# EasyEDA Pro project ProPrj_mfswControllerV1_2026-07-03.epro

# Schematic Schematic1
Board Name: Board1; Create Date: 2026-02-06; Page Name: P1; Project Name: mfswControllerV1; Schematic Name: Schematic1; Update Date: 2026-06-21; Company: EasyEDA.com; Page Size: A4; Version: V1.0
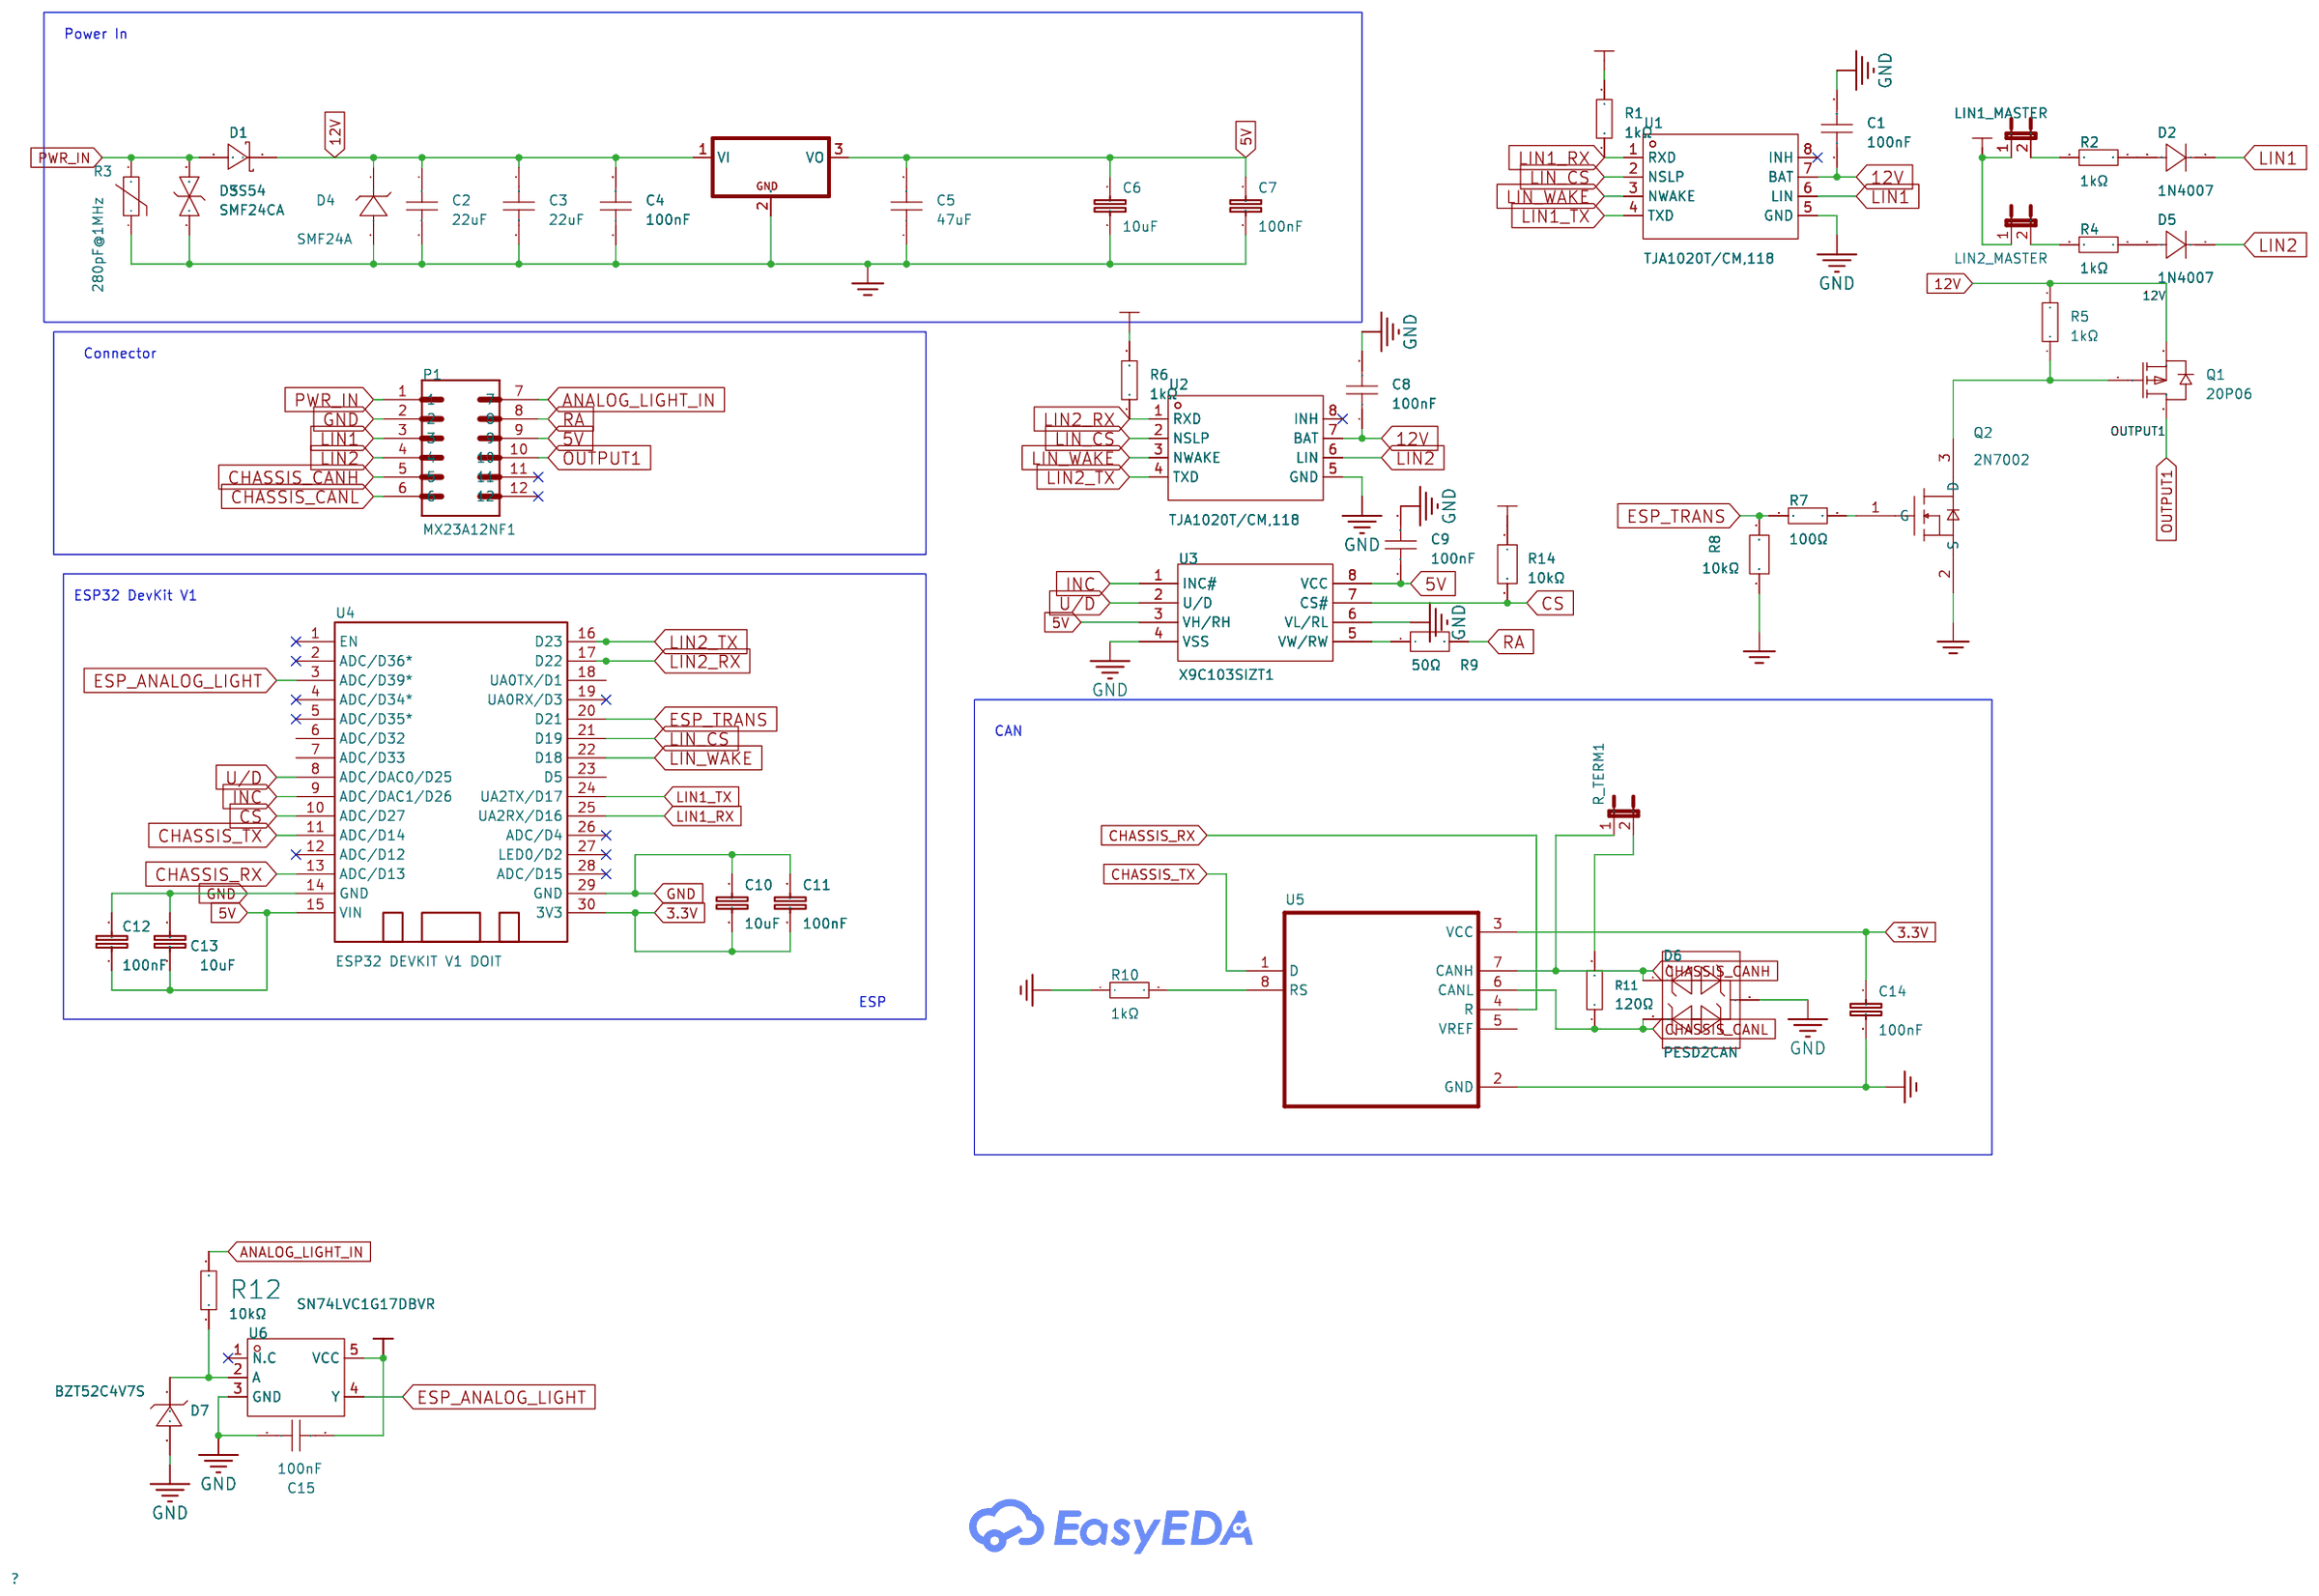
[diagram p0: schematic sheet]

## Parts
C1  100nF  [C0603]
C2  22uF  [C0805]
C3  22uF  [C0805]
C4  100nF  [C0603]
C5  47uF  [C0805]
C6  10uF  [C0805]
C7  100nF  [C0805]
C8  100nF  [C0603]
C9  100nF  [C0603]
C10  10uF  [C0805]
C11  100nF  [C0603]
C12  100nF  [C0603]
C13  10uF  [C0805]
C14  100nF  [C0805]
C15  100nF  [C0603]
D1  SS54  [SMA_L4.4-W2.8-LS5.4-R-RD]
D2  1N4007  [SMA_L4.3-W2.5-LS5.0-RD]
D3  SMF24CA  [SOD-123FL_L2.8-W1.8-LS3.7-BI]
D4  SMF24A  [SOD-123FL_L2.7-W1.8-LS3.8-RD]
D5  1N4007  [SMA_L4.3-W2.5-LS5.0-RD]
D6  PESD2CAN  [SOT-23-3_L2.9-W1.3-P1.90-LS2.4-BR]
D7  BZT52C4V7S  [SOD-323_L1.8-W1.3-LS2.5-RD]
IC1  L7805ABD2T-TR  [TO-263-2_L10.0-W9.2-P5.08-LS15.3-TL-CW]
LIN1_MASTER  PZ254V-11-02P  [HDR-TH_2P-P2.54-V-M]
LIN2_MASTER  PZ254V-11-02P  [HDR-TH_2P-P2.54-V-M]
P1  MX23A12NF1  [COON-TH_MX23A12NF1]
Q1  20P06  [TO-252-2_L6.6-W6.1-P4.57-LS9.9-BR-CW]
Q2  2N7002  [SOT-23-3_L2.9-W1.3-P1.90-LS2.4-BR]
R1  1kΩ  [R0603]
R2  1kΩ  [R0603]
R3  280pF@1MHz  [R0805]
R4  1kΩ  [R0603]
R5  1kΩ  [R0603]
R6  1kΩ  [R0603]
R7  100Ω  [R0603]
R8  10kΩ  [R0603]
R9  50Ω  [R0402]
R10  1kΩ  [R0603]
R11  120Ω  [R0603]
R12  10kΩ  [R0603]
R14  10kΩ  [R0603]
R_TERM1  PZ254V-11-02P  [HDR-TH_2P-P2.54-V-M]
U1  TJA1020T/CM,118  [SOIC-8_L4.9-W3.9-P1.27-LS6.0-BL]
U2  TJA1020T/CM,118  [SOIC-8_L4.9-W3.9-P1.27-LS6.0-BL]
U3  X9C103SIZT1  [SOIC-8_L5.0-W4.0-P1.27-LS6.0-BL]
U4  ESP32 DEVKIT V1 DOIT  [DOIT-ESP32-DEVKIT-V1]
U5  SN65HVD230DR  [SOIC-8_L4.9-W3.9-P1.27-LS6.0-BL]
U6  SN74LVC1G17DBVR  [SOT-23-5_L3.0-W1.5-P0.95-LS2.8-BL]

## Library data of the parts
C1 C4 C8 C9 C15 = CL10B104KB8NNNC: Capacitance:100nF Tolerance:±10% Tolerance:±10% Voltage Rating:50V Temperature Coefficient:X7R; LCSC Part Name: 100nF ±10% 50V; Supplier Part: C1591; Manufacturer: SAMSUNG(三星); Supplier Footprint: 0603; JLCPCB Part Class: Extended Part; Datasheet: https://item.szlcsc.com/datasheet/CL10B104KB8NNNC/1943.html; Supplier: LCSC; Tolerance: ±10%; Voltage Rating: 50V; Temperature Coefficient: X7R
C2 C3 = HGC0805R5226M350NSLJ: Capacitance: Tolerance:±20% Tolerance:±20% Voltage Rated: Temperature Coefficient:; LCSC Part Name: 22uF ±20% 35V; Supplier Part: C22367832; Manufacturer: Chinocera(华瓷); Supplier Footprint: 0805; JLCPCB Part Class: Extended Part; Datasheet: https://atta.szlcsc.com/upload/public/pdf/source/20240326/E9E9157D170E907C889ABA1F54A94302.pdf; Supplier: LCSC; Tolerance: ±20%; Standardization Check: false
C5 = CL21A476MPYNNWE: Capacitance:47uF Tolerance:±20% Tolerance:±20% Voltage Rating:10V Temperature Coefficient:X5R; LCSC Part Name: 47uF ±20% 10V; Supplier Part: C5596752; Manufacturer: SAMSUNG(三星); Supplier Footprint: 0805; JLCPCB Part Class: Extended Part; Datasheet: https://item.szlcsc.com/datasheet/CL21A476MPYNNWE/6515219.html; Supplier: LCSC; Tolerance: ±20%; Voltage Rating: 10V; Temperature Coefficient: X5R
C6 C10 C13 = CL21A106KAYNNNE_C15850: Capacitance: Tolerance:±10% Tolerance:±10% Voltage Rated: Temperature Coefficient:; LCSC Part Name: 10uF ±10% 25V; Supplier Part: C15850; Manufacturer: SAMSUNG(三星); Manufacturer Part: CL21A106KAYNNNE; Supplier Footprint: 0805; JLCPCB Part Class: Basic Part; Datasheet: https://atta.szlcsc.com/upload/public/pdf/source/20160218/1457707763339.pdf; Supplier: LCSC; Tolerance: ±10%
C7 C14 = CT41G-0805-2X1-50V-0.1μF-K(N): Capacitance:100nF Tolerance:±10% Tolerance:±10% Voltage Rating:50V Temperature Coefficient:-; LCSC Part Name: 100nF ±10% 50V; Supplier Part: C126469; Manufacturer: TORCH(火炬); Supplier Footprint: 0805; JLCPCB Part Class: Extended Part; Datasheet: https://atta.szlcsc.com/upload/public/pdf/source/20171225/C150708_15141883600121203188.pdf; Supplier: LCSC; Tolerance: ±10%; Voltage Rating: 50V
C11 C12 = CC0603KRX7R9BB104: Capacitance:100nF Tolerance:±10% Tolerance:±10% Voltage Rating:50V Temperature Coefficient:X7R; LCSC Part Name: 100nF ±10% 50V; Supplier Part: C14663; Manufacturer: YAGEO(国巨); Supplier Footprint: 0603; JLCPCB Part Class: Basic Part; Datasheet: https://atta.szlcsc.com/upload/public/pdf/source/20250214/096C4C206003071F5D32E5F0D8E7F8DF.pdf; Supplier: LCSC; Tolerance: ±10%; Voltage Rating: 50V; Temperature Coefficient: X7R
D1 = SS54_C22452: Diode Configuration:Independent Type Forward Voltage (Vf@If):550mV@5A Reverse Voltage (Vr):40V Rectified Current:5A Reverse Leakage Current (Ir):1mA@40V; LCSC Part Name: 电压:40V 电流:5A; Supplier Part: C22452; Manufacturer: MDD(辰达半导体); Supplier Footprint: SMA(DO-214AC); JLCPCB Part Class: Basic Part; Datasheet: https://atta.szlcsc.com/upload/public/pdf/source/20240710/73DFBB65C1883B895E62D589679033DF.pdf; Supplier: LCSC; Diode Configuration: Independent Type; Forward Voltage (Vf@If): 550mV@5A; Reverse Voltage (Vr): 40V; Rectified Current: 5A; Reverse Leakage Current (Ir): 1mA@40V
D2 D5 = 1N4007_C727081: Diode Configuration:Independent Voltage - Forward(Vf@If):1.1V@1A Voltage - DC Reverse(Vr):1kV Current - Rectified:1A Reverse Leakage Current (Ir):5uA; Supplier Part: C727081; Manufacturer: TWGMC(迪嘉); Supplier Footprint: SMA(DO-214AC); JLCPCB Part Class: Extended Part; Datasheet: https://item.szlcsc.com/datasheet/1N4007/774186.html; Supplier: LCSC; Diode Configuration: Independent; Voltage - Forward(Vf@If): 1.1V@1A; Voltage - DC Reverse(Vr): 1kV; Current - Rectified: 1A; Reverse Leakage Current (Ir): 5uA
D3 = SMF24CA_C353294: Reverse Stand-Off Voltage (Vrwm):24V Maximum Clamping Voltage:38.9V Peak Pulse Current (Ipp)@10/1000us:5.1A Breakdown Voltage:26.7V Reverse Leakage Current (Ir):1uA Type:TVS; Supplier Part: C353294; Manufacturer: 晶导微电子; Supplier Footprint: SOD-123FL; JLCPCB Part Class: Extended Part; Datasheet: https://atta.szlcsc.com/upload/public/pdf/source/20201106/C438024_76561727B84E8C9F41A4B4461A8AA838.pdf; Supplier: LCSC; Reverse Stand-Off Voltage (Vrwm): 24V; Maximum Clamping Voltage: 38.9V; Peak Pulse Current (Ipp)@10/1000us: 5.1A; Breakdown Voltage: 26.7V; Reverse Leakage Current (Ir): 1uA; Type: TVS
D4 = SMF24A_C19077514: Polarity:Unidirectional Reverse Stand-Off Voltage (Vrwm):24V Clamping Voltage:38.9V Peak Pulse Current (Ipp):5.1A@10/1000us Peak Pulse Power Dissipation (Ppp):200W@10/1000us Voltage - Breakdown:29.5V Reverse Leakage Current (Ir):1uA Number of Channels:1.0; LCSC Part Name: 单向TVS 24V截止 峰值浪涌电流：5.1A@10/1000us; Supplier Part: C19077514; Manufacturer: R+O(宏嘉诚); Supplier Footprint: SOD-123FL; JLCPCB Part Class: Extended Part; Datasheet: https://item.szlcsc.com/datasheet/SMF24A/20275599.html; Supplier: LCSC; Polarity: Unidirectional; Reverse Stand-Off Voltage (Vrwm): 24V; Clamping Voltage: 38.9V; Peak Pulse Current (Ipp): 5.1A@10/1000us; Peak Pulse Power Dissipation (Ppp): 200W@10/1000us; Voltage - Breakdown: 29.5V; Reverse Leakage Current (Ir): 1uA; Number of Channels: 1; Operating Temperature: -55℃~+150℃; level of protection: IEC 61000-4-2; Type: TVS
D6 = PESD2CAN_C907830: Polarity:Bidirectional Reverse Stand-Off Voltage (Vrwm):24V Clamping Voltage:50V Peak Pulse Current (Ipp):5.5A@8/20us Peak Pulse Power Dissipation (Ppp):250W@8/20us Voltage - Breakdown:32V Reverse Leakage Current (Ir):80nA Number of Channels:2 Operating T; LCSC Part Name: 丝印为6Rt 双向ESD 24V截止 峰值浪涌电流：5.5A@8/20us; Supplier Part: C907830; Manufacturer: TECH PUBLIC(台舟); Supplier Footprint: SOT-23; JLCPCB Part Class: Extended Part; Datasheet: https://item.szlcsc.com/datasheet/PESD2CAN/973917.html; Supplier: LCSC; Polarity: Bidirectional; Reverse Stand-Off Voltage (Vrwm): 24V; Clamping Voltage: 50V; Peak Pulse Current (Ipp): 5.5A@8/20us; Peak Pulse Power Dissipation (Ppp): 250W@8/20us; Voltage - Breakdown: 32V; Reverse Leakage Current (Ir): 80nA; Number of Channels: 2; Operating Temperature: -55℃~+125℃; level of protection: IEC 61000-4-2；IEC 61000-4-4；IEC 61000-4-5; Type: ESD; Junction Capacitance: 17pF
D7 = BZT52C4V7S_C353517: Diode Configuration:Independent Zener Voltage(Nom):4.7V Reverse Leakage Current (Ir):3uA@2V Zener Voltage(Range):4.4V~5V Zener Voltage(Range):4.4V~5V Pd - Power Dissipation:200mW Impedance(Zzt):80Ω Operating Junction Temperature Range:-55℃~+150℃ Operating; LCSC Part Name: 独立式 耐压:4.7V 电流:3uA@2V; Supplier Part: C353517; Manufacturer: 晶导微电子; Supplier Footprint: SOD-323; JLCPCB Part Class: Extended Part; Datasheet: https://item.szlcsc.com/datasheet/BZT52C4V7S/329266.html; Supplier: LCSC; Diode Configuration: Independent; Zener Voltage(Nom): 4.7V; Reverse Leakage Current (Ir): 3uA@2V; Zener Voltage(Range): 4.4V~5V; Pd - Power Dissipation: 200mW; Impedance(Zzt): 80Ω; Operating Junction Temperature Range: -55℃~+150℃
IC1 = L7805ABD2T-TR: Output Type:Fixed Maximum Input Voltage:35V Output Voltage:5V Output Voltage:5V Output Current:1.5A Power Supply Rejection Ratio (PSRR):68dB@(120Hz) Dropout Voltage:2V@(1A) standby current:6mA Feature:Short-Circuit  Protection；Thermal Protection(TSD) Oper; LCSC Part Name: 正稳压器IC; Supplier Part: C86206; Manufacturer: ST(意法半导体); Supplier Footprint: TO-263-2; JLCPCB Part Class: Extended Part; Datasheet: https://atta.szlcsc.com/upload/public/pdf/source/20191219/C472632_C0855675BBC73B8C8E44EE1325AAD56A.pdf; Supplier: LCSC; Output Type: Fixed; Maximum Input Voltage: 35V; Output Voltage: 5V; Output Current: 1.5A; Power Supply Rejection Ratio (PSRR): 68dB@(120Hz); Dropout Voltage: 2V@(1A); standby current: 6mA; Feature: Short-Circuit  Protection；Thermal Protection(TSD); Operating Temperature: -40℃~+125℃; Output Polarity: Positive electrode; Number of Outputs: 1
LIN1_MASTER LIN2_MASTER R_TERM1 = PZ254V-11-02P: Pin Structure:1x2P Pitch:2.54mm Row Spacing:- Circluar Pins/Square Pins:Policy Mounting Type:Straight Number of Rows:Single Row Number of Pins:2P Current Rating:- Voltage Rating (Max):- Length of Mating Pin:6mm Insulation Height:2.5mm Length of End Connec; LCSC Part Name: 1x2P 间距:2.54mm 方针 直插; Supplier Part: C492401; Manufacturer: XFCN(兴飞); Supplier Footprint: 插件,P=2.54mm; JLCPCB Part Class: Extended Part; Datasheet: https://atta.szlcsc.com/upload/public/pdf/source/20200309/C492401_A812433581A9B211A7FFA413ADDFF0E5.pdf; Supplier: LCSC; Pin Structure: 1x2P; Pitch: 2.54mm; Circluar Pins/Square Pins: Policy; Mounting Type: Straight; Number of Rows: Single Row; Number of Pins: 2P; Length of Mating Pin: 6mm; Insulation Height: 2.5mm; Length of End Connection Pin: 3mm; Contact Material: Brass; Operating Temperature: -40℃~+105℃; Color: Black
P1 = MX23A12NF1: Supplier Part: C5359486; Manufacturer: JAE(日本航空电子); JLCPCB Part Class: Extended Part; Datasheet: https://atta.szlcsc.com/upload/public/pdf/source/20230330/B7F7CF0886F51BD2154D3E2774694052.pdf; Supplier: LCSC
Q1 = 20P06: Type:1 Piece P-Channel Drain Source Voltage (Vdss):60V Continuous Drain Current (Id): Drain Source On Resistance (RDS(on)@Vgs,Id):48mΩ Gate Threshold Voltage (Vgs(th)@Id):2.5V; LCSC Part Name: 1个P沟道 耐压:60V 电流:20A; Supplier Part: C18164394; Manufacturer: HL(富海微); Supplier Footprint: TO-252; JLCPCB Part Class: Extended Part; Datasheet: https://atta.szlcsc.com/upload/public/pdf/source/20231012/DDB4F5E9C77D3DD288E1321309E3ABAC.pdf; Supplier: LCSC; Type: 1 Piece P-Channel; Drain Source Voltage (Vdss): 60V; Drain Source On Resistance (RDS(on)@Vgs,Id): 48mΩ; Gate Threshold Voltage (Vgs(th)@Id): 2.5V
Q2 = 2N7002_C916396: Number:1 N-channel Drain to Source Voltage:60V Current - Continuous Drain(Id):115mA RDS(on):1.7Ω@5V Pd - Power Dissipation:200mW Gate Threshold Voltage (Vgs(th)):2.5V Gate Charge(Qg):- Input Capacitance(Ciss):50pF Reverse Transfer Capacitance (Crss@Vds):5; LCSC Part Name: 1个N沟道 耐压:60V 电流:115mA; Supplier Part: C916396; Manufacturer: JSMSEMI(杰盛微); Supplier Footprint: SOT-23; JLCPCB Part Class: Extended Part; Datasheet: https://item.szlcsc.com/datasheet/2N7002/990892.html; Supplier: LCSC; Number: 1 N-channel; Drain to Source Voltage: 60V; Current - Continuous Drain(Id): 115mA; RDS(on): 1.7Ω@5V; Pd - Power Dissipation: 200mW; Gate Threshold Voltage (Vgs(th)): 2.5V; Input Capacitance(Ciss): 50pF; Reverse Transfer Capacitance (Crss@Vds): 5pF; Operating Temperature: -55℃~+150℃
R1 R2 R4-R6 R10 = 0603WAF1001T5E: Type:Thick Film Resistors Resistance:1kΩ Tolerance:±1% Tolerance:±1% Power(Watts): Overload Voltage (Max): Temperature Coefficient:±100ppm/℃ Temperature Coefficient:±100ppm/℃ Operating Temperature Range:-55℃~+155℃ Operating Temperature Range:-55℃~+155℃; LCSC Part Name: 1kΩ ±1% 100mW 厚膜电阻; Supplier Part: C21190; Manufacturer: UNI-ROYAL(厚声); Supplier Footprint: 0603; JLCPCB Part Class: Basic Part; Datasheet: https://atta.szlcsc.com/upload/public/pdf/source/20200306/C422600_1E6D84923E4A46A82E41ADD87F860B5C.pdf; Supplier: LCSC; Type: Thick Film Resistors; Tolerance: ±1%; Temperature Coefficient: ±100ppm/℃; Operating Temperature Range: -55℃~+155℃
R3 = FPV201209E260PKT: Varistor Voltage:36V Varistor Voltage:36V Clamping Voltage:63V Maximum DC Volts:26V Maximum AC Volts:18.4V Peak Current:100A Energy:0.3J Energy:0.3J Capacitance:280pF@1MHz Rated Wattage:-; LCSC Part Name: 钳位电压63V 0.3焦耳 0805压敏电阻; Supplier Part: C2991545; Manufacturer: FH(风华); Supplier Footprint: 0805; JLCPCB Part Class: Extended Part; Datasheet: https://atta.szlcsc.com/upload/public/pdf/source/20181030/C304296_DDDABF933F96CAF6D0EBDDE0D30269D0.pdf; Supplier: LCSC; Varistor Voltage: 36V; Clamping Voltage: 63V; Maximum DC Volts: 26V; Maximum AC Volts: 18.4V; Peak Current: 100A; Energy: 0.3J
R7 = RT0603BRD07100RL: Type:Thin Film Resistor Resistance: Tolerance:±0.1% Tolerance:±0.1% Power(Watts): Overload Voltage (Max): Temperature Coefficient:±25ppm/℃ Temperature Coefficient:±25ppm/℃ Operating Temperature Range:-55℃~+155℃ Operating Temperature Range:-55℃~+155℃; LCSC Part Name: 薄膜电阻 100Ω ±0.1% 100mW; Supplier Part: C122970; Manufacturer: YAGEO(国巨); Supplier Footprint: 0603; JLCPCB Part Class: Extended Part; Datasheet: https://atta.szlcsc.com/upload/public/pdf/source/20180716/C95646_694A11296E8D6C27B0592E54BC4097D1.pdf; Supplier: LCSC; Type: Thin Film Resistor; Tolerance: ±0.1%; Temperature Coefficient: ±25ppm/℃; Operating Temperature Range: -55℃~+155℃
R8 R12 R14 = ESR03EZPF1002: Type:Thick Film Resistors Resistance: Tolerance:±1% Tolerance:±1% Power(Watts):250mW Overload Voltage (Max): Temperature Coefficient:±100ppm/℃ Temperature Coefficient:±100ppm/℃ Operating Temperature Range:-55℃~+155℃ Operating Temperature Range:-55℃~+155℃; LCSC Part Name: 厚膜电阻 10kΩ ±1% 250mW; Supplier Part: C510087; Manufacturer: ROHM(罗姆); Supplier Footprint: 0603; JLCPCB Part Class: Extended Part; Datasheet: https://atta.szlcsc.com/upload/public/pdf/source/20200402/C507440_0D6349765BEB5A119E68F60BA27010ED.pdf; Supplier: LCSC; Type: Thick Film Resistors; Tolerance: ±1%; Power(Watts): 250mW; Temperature Coefficient: ±100ppm/℃; Operating Temperature Range: -55℃~+155℃
R9 = FRC0402F50R0TS: Type:Thick Film Resistor Resistance:50Ω Tolerance:±1% Tolerance:±1% Power(Watts):62.5mW Voltage-Supply(Max):50V Temperature Coefficient:±100ppm/℃ Temperature Coefficient:±100ppm/℃ Operating Temperature:-55℃~+155℃ Operating Temperature:-55℃~+155℃; LCSC Part Name: 厚膜电阻 50Ω ±1% 62.5mW; Supplier Part: C51048227; Manufacturer: FOJAN(富捷); Supplier Footprint: 0402; JLCPCB Part Class: Extended Part; Datasheet: https://item.szlcsc.com/datasheet/FRC0402F50R0TS/53696861.html; Supplier: LCSC; Type: Thick Film Resistor; Tolerance: ±1%; Power(Watts): 62.5mW; Voltage-Supply(Max): 50V; Temperature Coefficient: ±100ppm/℃; Operating Temperature: -55℃~+155℃
R11 = 0603WAF1200T5E: Type:Thick Film Resistors Resistance: Tolerance:±1% Tolerance:±1% Power(Watts): Overload Voltage (Max): Temperature Coefficient:±100ppm/℃ Temperature Coefficient:±100ppm/℃ Operating Temperature Range:-55℃~+155℃ Operating Temperature Range:-55℃~+155℃; LCSC Part Name: 120Ω ±1% 100mW 厚膜电阻; Supplier Part: C22787; Manufacturer: UNI-ROYAL(厚声); Supplier Footprint: 0603; JLCPCB Part Class: Basic Part; Datasheet: https://atta.szlcsc.com/upload/public/pdf/source/20200306/C422600_1E6D84923E4A46A82E41ADD87F860B5C.pdf; Supplier: LCSC; Type: Thick Film Resistors; Tolerance: ±1%; Temperature Coefficient: ±100ppm/℃; Operating Temperature Range: -55℃~+155℃
U1 U2 = TJA1020T/CM,118: Type:Transceiver Duplex:- Number of Drivers:1 Number of Receivers:1 Voltage - Supply:5V~27V Voltage - Supply:5V~27V Current - Supply:8mA Supply Current (Iq):3uA ESD Protect:±4kV ESD Protect:±4kV; LCSC Part Name: LIN收发器; Supplier Part: C6950; Manufacturer: NXP(恩智浦); Supplier Footprint: SOIC-8; JLCPCB Part Class: Extended Part; Datasheet: https://www.nxp.com/docs/en/data-sheet/TJA1020.pdf; Supplier: LCSC; Type: Transceiver; Number of Drivers: 1; Number of Receivers: 1; Voltage - Supply: 5V~27V; Current - Supply: 8mA; Supply Current (Iq): 3uA; ESD Protect: ±4kV
U3 = X9C103SIZT1: Resistance Value (Ohms):10kΩ Number of Taps:100 Number of Channels:1 Tolerance:±20% Tolerance:±20% Voltage - Supply:5V Voltage - Supply:5V Interface:- Temperature Coefficient(Typ):±300ppm/℃ Temperature Coefficient(Typ):±300ppm/℃ Operating Temperature:-40℃; Supplier Part: C11973; Manufacturer: RENESAS(瑞萨)/IDT; Supplier Footprint: SOIC-8; JLCPCB Part Class: Extended Part; Datasheet: https://item.szlcsc.com/datasheet/X9C103SIZT1/12528.html; Supplier: LCSC; Resistance Value (Ohms): 10kΩ; Number of Taps: 100; Number of Channels: 1; Tolerance: ±20%; Voltage - Supply: 5V; Temperature Coefficient(Typ): ±300ppm/℃; Operating Temperature: -40℃~+85℃
U4 = ESP32 DEVKIT V1 DOIT
U5 = SN65HVD230DR: Type:CANtransceiver Data Rate:1Mbps Voltage - Supply:- Voltage - Supply:- Current - Supply:- Operating Temperature:-40℃~+85℃ Operating Temperature:-40℃~+85℃; LCSC Part Name: 3.3-V CAN 收发器; Supplier Part: C12084; Manufacturer: TI(德州仪器); Supplier Footprint: SOIC-8; JLCPCB Part Class: Extended Part; Datasheet: https://www.ti.com/cn/lit/gpn/sn65hvd230; Supplier: LCSC; Type: CANtransceiver; Data Rate: 1Mbps; Operating Temperature: -40℃~+85℃
U6 = SN74LVC1G17DBVR_C19829662: Supplier Part: C19829662; Manufacturer: TECH PUBLIC(台舟); Supplier Footprint: SOT-23-5; JLCPCB Part Class: Extended Part; Datasheet: https://atta.szlcsc.com/upload/public/pdf/source/20240202/EAF8B4F29332307745EEFE11873F995E.pdf; Supplier: LCSC

## Nets
3.3V: C10.2 C11.2 C14.1 C15.2 R1.2 R6.2 R14.1 U4.30(3V3) U5.3(VCC) U6.5(VCC)
5V: C5.2 C6.1 C7.1 C9.1 C12.1 C13.1 IC1.3(VO) P1.9 U3.3(VH/RH) U3.8(VCC) U4.15(VIN)
12V: C1.1 C2.1 C3.1 C4.2 C8.1 D1.2(K) D4.1(K) IC1.1(VI) LIN1_MASTER.1 LIN2_MASTER.1 Q1.3(S) R5.2 U1.7(BAT) U2.7(BAT)
GND: C1.2 C2.2 C3.2 C4.1 C5.1 C6.2 C7.2 C8.2 C9.2 C10.1 C11.1 C12.2 C13.2 C14.2 C15.1 D3.1 D4.2(A) D6.3 D7.2(A) IC1.2(GND) P1.2 Q2.2(S) R3.1 R8.1 R10.1 U1.5(GND) U2.5(GND) U3.4(VSS) U3.6(VL/RL) U4.14(GND) U4.29(GND) U5.2(GND) U6.3(GND)
ANALOG_LIGHT_IN: P1.7 R12.2
CHASSIS_CANH: D6.1 P1.5 R_TERM1.1 U5.7(CANH)
CHASSIS_CANL: D6.2 P1.6 R11.1 U5.6(CANL)
CHASSIS_RX: U4.13(ADC/D13) U5.4(R)
CHASSIS_TX: U4.11(ADC/D14) U5.1(D)
CS: R14.2 U3.7(CS#) U4.10(ADC/D27)
ESP_ANALOG_LIGHT: U4.3(ADC/D39*) U6.4(Y)
ESP_TRANS: R7.1 R8.2 U4.20(D21)
INC: U3.1(INC#) U4.9(ADC/DAC1/D26)
LIN1: D2.1(K) P1.3 U1.6(LIN)
LIN1_RX: R1.1 U1.1(RXD) U4.25(UA2RX/D16)
LIN1_TX: U1.4(TXD) U4.24(UA2TX/D17)
LIN2: D5.1(K) P1.4 U2.6(LIN)
LIN2_RX: R6.1 U2.1(RXD) U4.17(D22)
LIN2_TX: U2.4(TXD) U4.16(D23)
LIN_CS: U1.2(NSLP) U2.2(NSLP) U4.21(D19)
LIN_WAKE: U1.3(NWAKE) U2.3(NWAKE) U4.22(D18)
OUTPUT1: P1.10 Q1.2(D)
PWR_IN: D1.1(A) D3.2 P1.1 R3.2
RA: P1.8 R9.2
U/D: U3.2(U/D) U4.8(ADC/DAC0/D25)
$1N737: R11.2 R_TERM1.2
$1N743: R10.2 U5.8(RS)
$1N3329: LIN1_MASTER.2 R2.2
$1N3333: LIN2_MASTER.2 R4.2
$1N6845: R9.1 U3.5(VW/RW)
$1N12184: Q2.1(G) R7.2
$1N12187: Q1.1(G) Q2.3(D) R5.1
$1N12290: D7.1(K) R12.1 U6.2(A)
$1N14060: D2.2(A) R2.1
$1N14099: D5.2(A) R4.1

Not connected (* = marked no-connect by the designer): P1 11* 12*; U1 8(INH)*; U2 8(INH)*; U4 1(EN)* 2(ADC/D36*)* 4(ADC/D34*)* 5(ADC/D35*)* 6(ADC/D32) 7(ADC/D33) 12(ADC/D12)* 18(UA0TX/D1) 19(UA0RX/D3)* 23(D5) 26(ADC/D4)* 27(LED0/D2)* 28(ADC/D15)*; U5 5(VREF); U6 1(N.C)*

## Notes on the sheet
- Power In
- Connector
- ESP32 DevKit V1
- CAN
- ESP

# Board PCB1
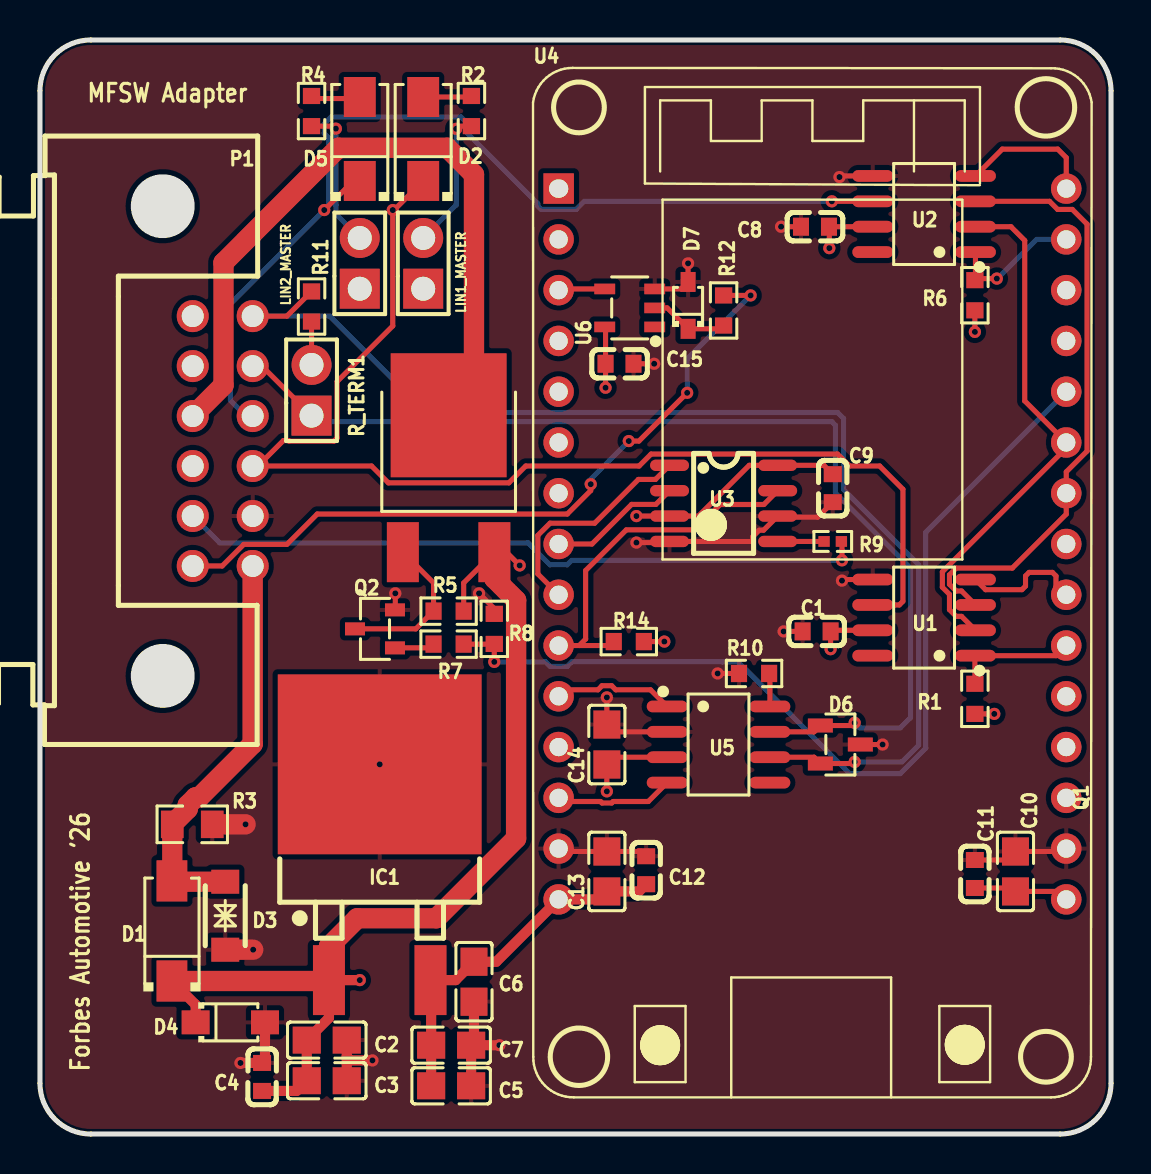
[diagram p1: board, top side]
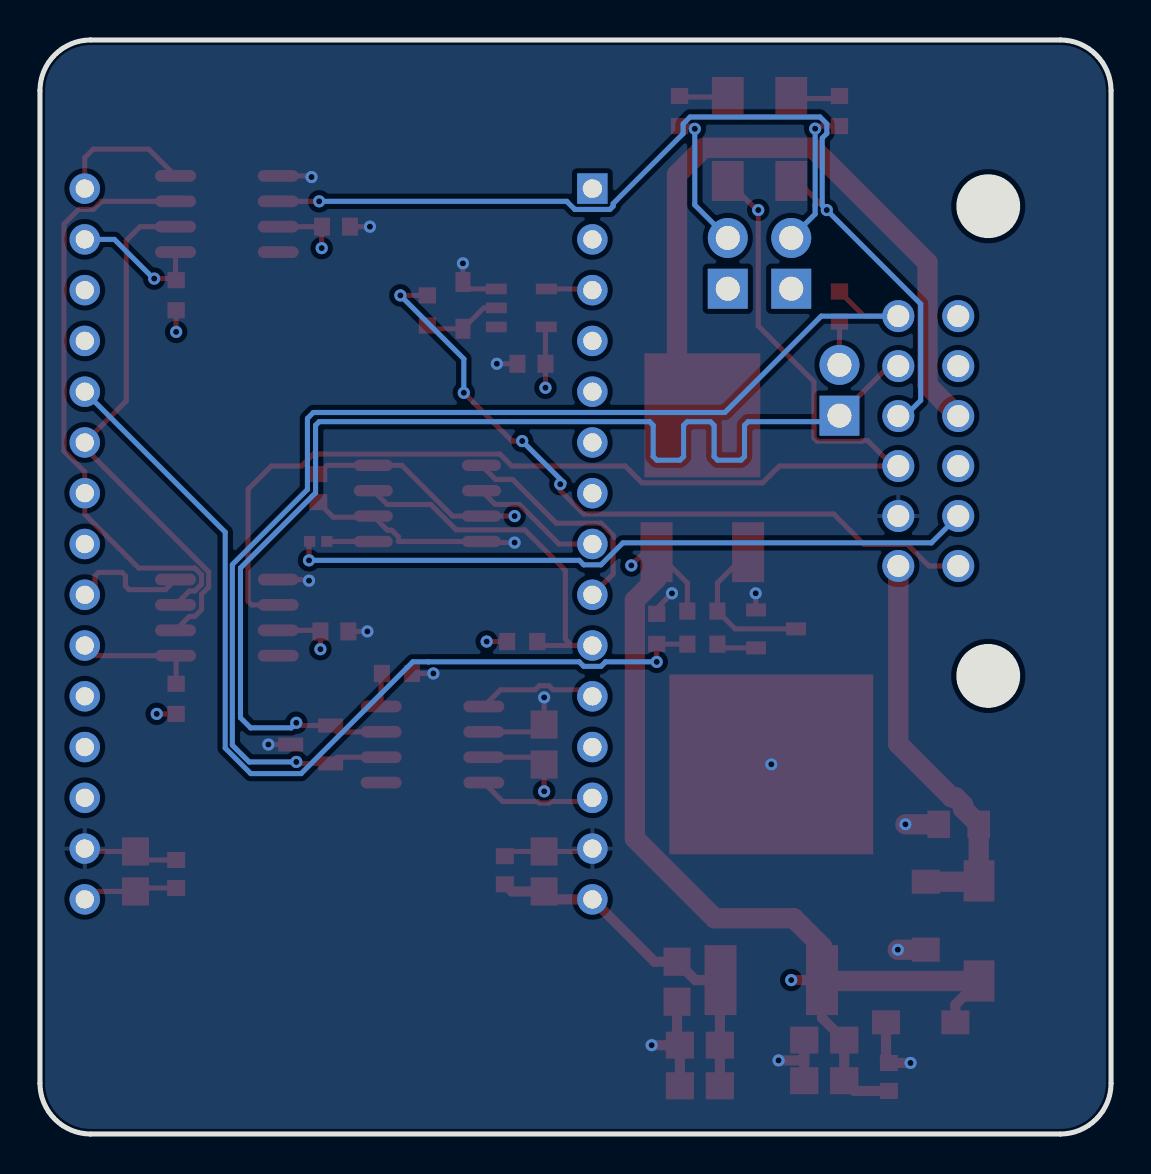
[diagram p2: board, bottom side, seen from below]

Outline 53.59 x 54.74 mm; copper layers: Top Layer, PWR, GND, Bottom Layer. Coordinates in mm from the lower left corner of the outline.
Outline path: 0,52.2 0,2.54 arc(0.74,0.74) 2.54,0 51.05,0 arc(52.85,0.74) 53.59,2.54 53.59,52.2 arc(52.85,53.99) 51.05,54.74 2.54,54.74 arc(0.74,53.99) 0,52.2
Stack: Top Layer 0.035mm Outer layer thickness 1oz / Dielectric1 0.2104mm 7628 RC49% 8.6mil / PWR 0.0152mm Inner layer thickness / Dielectric2 1.065mm 1.1mm H/HOZ Copper / GND 0.0152mm Inner layer thickness / Dielectric3 0.2104mm 7628 RC49% 8.6mil / Bottom Layer 0.035mm Outer layer thickness 1oz

## Design rules (mm)
net CHASSIS_CANH: DP4
net CHASSIS_CANL: DP4
net CHASSIS_TX: DP3
net CHASSIS_RX: DP3
net LIN1_TX: DP1
net LIN1_RX: DP1
net LIN2_TX: DP2
net LIN2_RX: DP2
template: JLCPCB Capability(Two Layers Board)
spacing copperThickness1oz (default): track to track 0.102, other pairs 0.152 to 0.3
spacing copperThickness2oz: track to track 0.203, other pairs 0.152 to 0.3
track width copperThickness1oz (default): min 0.127, default 0.254, max 2.54
track width copperThickness2oz: min 0.203, default 0.254, max 2.54
differential pair differentialPair (default): width min 0.127, default 0.254, max 2.54; gap min 0.152, default 0.152
via viaSize (default): diameter min 0.5, default 0.61, max 10; hole min 0.3, default 0.305, max 6.3

## Placement (name value [footprint] x y rotation side)
C1  100nF  [C0603]  38.86 25.15 180 top
C2  22uF  [C0805]  14.35 4.7 0 top
C3  22uF  [C0805]  14.35 2.67 0 top
C4  100nF  [C0603]  11.11 2.86 270 top
C5  47uF  [C0805]  20.57 2.41 180 top
C6  10uF  [C0805]  21.72 7.62 270 top
C7  100nF  [C0805]  20.57 4.44 0 top
C8  100nF  [C0603]  38.78 45.39 180 top
C9  100nF  [C0603]  39.67 32.31 270 top
C10  10uF  [C0805]  48.81 13.14 270 top
C11  100nF  [C0603]  46.78 13.01 270 top
C12  100nF  [C0603]  30.33 13.2 90 top
C13  10uF  [C0805]  28.37 13.14 90 top
C14  100nF  [C0805]  28.37 19.49 90 top
C15  100nF  [C0603]  29 38.54 180 top
D1  SS54  [SMA_L4.4-W2.8-LS5.4-R-RD]  6.6 10.16 90 top
D2  1N4007  [SMA_L4.3-W2.5-LS5.0-RD]  19.18 49.78 90 top
D3  SMF24CA  [SOD-123FL_L2.8-W1.8-LS3.7-BI]  9.27 10.92 90 top
D4  SMF24A  [SOD-123FL_L2.7-W1.8-LS3.8-RD]  9.52 5.59 0 top
D5  1N4007  [SMA_L4.3-W2.5-LS5.0-RD]  16 49.78 90 top
D6  PESD2CAN  [SOT-23-3_L2.9-W1.3-P1.90-LS2.4-BR#2]  40.05 19.49 180 top
D7  BZT52C4V7S  [SOD-323_L1.8-W1.3-LS2.5-RD]  32.43 41.46 90 top
IC1  L7805ABD2T-TR  [TO-263-2_L10.0-W9.2-P5.08-LS15.3-TL-CW]  17 13.1 90 top
LIN1_MASTER  PZ254V-11-02P  [HDR-TH_2P-P2.54-V-M]  19.18 43.56 90 top
LIN2_MASTER  PZ254V-11-02P  [HDR-TH_2P-P2.54-V-M]  16 43.56 90 top
P1  MX23A12NF1  [COON-TH_MX23A12NF1]  9.14 34.67 270 top
Q1  20P06  [TO-252-2_L6.6-W6.1-P4.57-LS9.9-BR-CW]  20.45 32.53 270 top
Q2  2N7002  [SOT-23-3_L2.9-W1.3-P1.90-LS2.4-BR]  16.76 25.27 0 top
R1  1kΩ  [R0603]  46.78 21.77 270 top
R2  1kΩ  [R0603]  21.59 51.18 270 top
R3  280pF@1MHz  [R0805]  7.62 15.49 180 top
R4  1kΩ  [R0603]  13.59 51.18 270 top
R5  1kΩ  [R0603]  20.45 26.16 0 top
R6  1kΩ  [R0603]  46.78 41.97 270 top
R7  100Ω  [R0603]  20.45 24.51 180 top
R8  10kΩ  [R0603]  22.73 25.27 270 top
R9  50Ω  [R0402]  39.67 29.65 0 top
R10  1kΩ  [R0603]  35.73 23.04 0 top
R11  120Ω  [R0603]  13.59 41.4 270 top
R12  10kΩ  [R0603]  34.21 41.2 90 top
R14  10kΩ  [R0603]  29.46 24.64 180 top
R_TERM1  PZ254V-11-02P  [HDR-TH_2P-P2.54-V-M]  13.59 37.21 90 top
U1  TJA1020T/CM,118  [SOIC-8_L4.9-W3.9-P1.27-LS6.0-BL]  44.24 25.84 90 top
U2  TJA1020T/CM,118  [SOIC-8_L4.9-W3.9-P1.27-LS6.0-BL]  44.24 46.03 90 top
U3  X9C103SIZT1  [SOIC-8_L5.0-W4.0-P1.27-LS6.0-BL]  34.21 31.55 270 top
U4  ESP32 DEVKIT V1 DOIT  [DOIT-ESP32-DEVKIT-V1]  25.95 47.3 0 top
U5  SN65HVD230DR  [SOIC-8_L4.9-W3.9-P1.27-LS6.0-BL]  33.95 19.49 270 top
U6  SN74LVC1G17DBVR  [SOT-23-5_L3.0-W1.5-P0.95-LS2.8-BL]  29.51 41.33 90 top

## Footprints (pads in the part's own frame, mm; a bottom-side part is the same pattern mirrored in y, then rotated)
C0603
  rect 0.8x0.9 smd: 1(-0.7,0) 2(0.7,0)
C0805
  rect 1.41x1.35 smd: 1(-1,0) 2(1,0)
COON-TH_MX23A12NF1
  round 1.6 hole 1.1: 1(6.25,1.5) 2(3.75,1.5) 3(1.25,1.5) 4(-1.25,1.5) 5(-3.75,1.5) 6(-6.25,1.5) 7(6.25,-1.5) 8(3.75,-1.5) 9(1.25,-1.5) 10(-1.25,-1.5) 11(-3.75,-1.5) 12(-6.25,-1.5)
DOIT-ESP32-DEVKIT-V1
  rect 1.524x1.524 hole 0.96x0.914: 1(0,0)
  round 1.524 hole 0.914: 2(0,-2.54) 3(0,-5.08) 4(0,-7.62) 5(0,-10.16) 6(0,-12.7) 7(0,-15.24) 8(0,-17.78) 9(0,-20.32) 10(0,-22.86) 11(0,-25.4) 12(0,-27.94) 13(0,-30.48) 14(0,-33.02) 15(0,-35.56) 16(25.4,0) 17(25.4,-2.54) 18(25.4,-5.08) 19(25.4,-7.62) 20(25.4,-10.16) 21(25.4,-12.7) 22(25.4,-15.24) 23(25.4,-17.78) 24(25.4,-20.32) 25(25.4,-22.86) 26(25.4,-25.4) 27(25.4,-27.94) 28(25.4,-30.48) 29(25.4,-33.02) 30(25.4,-35.56)
HDR-TH_2P-P2.54-V-M
  rect 2x2 hole 1.2: 1(-1.27,0)
  round 2 hole 1.2: 2(1.27,0)
R0402
  rect 0.566x0.54 smd: 1(-0.433,0) 2(0.433,0)
R0603
  rect 0.806x0.864 smd: 1(-0.753,0) 2(0.753,0)
R0805
  rect 1.133x1.377 smd: 1(-1,0) 2(1,0)
SMA_L4.3-W2.5-LS5.0-RD
  rect 2x1.593 smd: 1(-2.1,0) 2(2.1,0)
SMA_L4.4-W2.8-LS5.4-R-RD
  rect 2.062x1.539 smd: 1(2.503,0) 2(-2.503,0)
SOD-123FL_L2.7-W1.8-LS3.8-RD
  rect 1.4x1.2 smd: 1(-1.735,0) 2(1.735,0)
SOD-123FL_L2.8-W1.8-LS3.7-BI
  rect 1.2x1.4 smd: 1(-1.7,0) 2(1.7,0)
SOD-323_L1.8-W1.3-LS2.5-RD
  rect 1x0.75 smd: 1(-1.173,0) 2(1.173,0)
SOIC-8_L4.9-W3.9-P1.27-LS6.0-BL
  oval 0.588x2.045 smd: 1(-1.905,-2.57) 2(-0.635,-2.57) 3(0.635,-2.57) 4(1.905,-2.57) 5(1.905,2.57) 6(0.635,2.57) 7(-0.635,2.57) 8(-1.905,2.57)
SOIC-8_L5.0-W4.0-P1.27-LS6.0-BL
  oval 0.569x1.95 smd: 1(-1.905,-2.705) 2(-0.635,-2.705) 3(0.635,-2.705) 4(1.905,-2.705) 5(1.905,2.705) 6(0.635,2.705) 7(-0.635,2.705) 8(-1.905,2.705)
SOT-23-3_L2.9-W1.3-P1.90-LS2.4-BR
  rect 1x0.65 smd: 1(1,-0.95) 2(1,0.95) 3(-1,0)
SOT-23-3_L2.9-W1.3-P1.90-LS2.4-BR#2
  rect 1.25x0.7 smd: 1(1,-0.95) 2(1,0.95) 3(-1,0)
SOT-23-5_L3.0-W1.5-P0.95-LS2.8-BL
  rect 0.532x1.045 smd: 1(-0.95,-1.25) 2(0,-1.25) 3(0.95,-1.25) 4(0.95,1.25) 5(-0.95,1.25)
TO-252-2_L6.6-W6.1-P4.57-LS9.9-BR-CW
  rect 3x1.6 smd: 1(3.424,-2.29) 3(3.424,2.29)
  rect 6.2x5.8 smd: 2(-3.424,0)
TO-263-2_L10.0-W9.2-P5.08-LS15.3-TL-CW
  rect 3.5x1.6 smd: 1(-5.397,2.54) 3(-5.397,-2.54)
  rect 9x10.2 smd: 2(5.397,0)

## Nets
As in the schematic.

Pads without a net: P1 11 12; U1 8; U2 8; U4 1 2 4 5 6 7 12 18 19 23 26 27 28; U5 5; U6 1

## Via types
v1: diameter 0.61, hole 0.305, Top Layer to Bottom Layer, 42 vias

## Routing (per net, layer and track width the routed paths; a pad name or vN(x,y) marks a point on that pad's centre or on a via; arc(x,y) is an arc through that point)
3.3V: length 95.3
  Top Layer w0.254: 28.26,40.38 28.3,40.34 C15.2 v1(28.3,37.34) ; U4.30 50.96,12.14 C10.2 48.64,12.31 C11.2 ; R6.2 v1(46.78,40.13) ; U5.3 28.73,18.85 C14.1 v1(28.37,17.14) ; R14.1 v1(31.24,24.64) ; R1.2 v1(47.75,21.02)
  PWR w0.254: U4.30 47.75,15.34 v1(47.75,21.02) ; v1(31.24,24.64) 31.24,20.02 v1(28.37,17.14) 43.88,17.14 v1(47.75,21.02) ; v1(47.75,21.02) 46.78,21.99 v1(46.78,40.13) 43.99,37.34 32.96,37.34 32.63,37.67 32.14,37.67 31.81,37.34 v1(28.3,37.34)
5V: length 79.8
  Top Layer w0.254: C9.1 39.23,33.46 U3.8 35.49,33.46 32.95,30.92 v1(29.84,30.92)
  Top Layer w0.508: C12.1 29.97,12.14 C13.1 27.97,11.74 U4.15 22.83,8.62 C6.1 20.8,7.7 IC1.3 19.57,7.67 C7.1 C5.2
  PWR w0.254: U4.15 27.78,13.57 27.78,28.35 29.84,30.42 v1(29.84,30.92)
  PWR w0.508: U4.15 13.04,24.65 12.18,24.65 9.44,27.39 9.44,31.73 7.75,33.42 P1.9
12V: length 124.5
  Top Layer w0.254: v1(39.56,24.26) C1.1 39.62,25.2 41.67,25.2 ; v1(39.5,44.32) 39.5,45.38 C8.1 41.67,45.39 ; R5.2 21.2,27.57 Q1.3 23.34,29.11 v1(24,28.45)
  Top Layer w0.508: D4.1 7.79,6.47 D1.2 ; C4.2 12.84,2.16 C3.1 C2.1 14.46,5.81 IC1.1 v1(16,7.7)
  Top Layer w1.016: D1.2 14.42,7.66 IC1.1 14.46,9.38 15.87,10.8 19.83,10.8 23.83,14.79 23.83,26.7 22.74,27.79 Q1.3
  PWR w0.254: LIN1_MASTER.1 LIN2_MASTER.1 ; LIN1_MASTER.1 21.21,44.32 24.92,44.32 25.52,43.72 26.38,43.72 26.99,44.32 v1(39.5,44.32) ; LIN1_MASTER.1 24,37.47 v1(24,28.45) 24.91,27.54 24.91,26.55 25.52,25.94 26.38,25.94 27.43,26.98 27.43,28.5 29.26,30.34 29.26,31.16 29.6,31.5 30.09,31.5 35.52,26.07 35.52,25.16 36.43,24.26 v1(39.56,24.26)
GND: length 53.4
  Top Layer w0.254: U4.14 26.1,14.14 C13.2 30.09,14.14 C12.2 ; v1(17.78,27.05) 17.78,26.24 Q2.2 ; 41.67,47.94 40.06,47.94 v1(40.01,47.88) ; v1(21.97,27.05) 22.73,26.29 R8.1 ; 41.67,27.74 40.19,27.74 v1(40.13,27.69) ; C9.2 38.92,30.86 36.97,30.86 36.91,30.92 36.21,30.21 35.99,30.21 35.66,29.88 35.66,29.66 35.64,29.65 U3.4 31.45,29.59 v1(29.84,29.59) ; v1(28.37,21.84) C14.2 28.73,20.12 U5.2 ; U6.3 32.08,42.28 D7.2 v1(32.43,43.56) ; R10.1 v1(33.91,23.04) ; D6.3 v1(42.16,19.49) ; C8.2 v1(37.08,45.39) ; C1.2 v1(37.21,25.15) ; U4.29 51.21,14.14 C10.1 48.39,13.71 C11.1 ; 29.7,38.54 v1(30.73,38.54)
  Top Layer w0.508: C7.2 v1(22.99,4.44) ; C7.2 C5.1 ; C7.2 21.72,4.59 C6.2 ; D4.2 11.26,3.7 C4.1 v1(10.03,3.56) ; 15.35,3.87 C3.2 ; 15.35,3.87 15.54,3.68 v1(16.64,3.68) ; 15.35,3.87 C2.2
  Top Layer w1.016: D3.1 v1(10.67,9.22) ; R3.1 v1(10.29,15.49)
  vias: v1(17,18.5)
ANALOG_LIGHT_IN: length 36.4
  Top Layer w0.254: P1.7 9.12,28.42 10.2,29.5 12.36,29.5 13.87,31.02 26.38,31.02 27.56,32.19 v1(27.56,32.51) ; v1(35.56,41.96) R12.2 ; v1(29.46,34.67) 29.97,34.67 v1(32.39,37.08)
  Bottom Layer w0.254: v1(27.56,32.51) 27.49,32.58 27.38,32.58 v1(29.46,34.67) ; v1(32.39,37.08) 32.39,38.78 v1(35.56,41.96)
CHASSIS_CANH: length 61
  Top Layer w0.254: R_TERM1.1 11.11,38.42 P1.5 ; U5.7 38.74,20.12 D6.1 40.63,20.44 v1(40.77,20.57)
  Bottom Layer w0.254: R_TERM1.1 13.89,35.64 18.16,35.64 18.34,35.46 18.34,33.89 18.52,33.71 19.68,33.71 19.86,33.89 19.86,35.46 20.04,35.64 21.21,35.64 21.39,35.46 21.39,33.89 21.57,33.71 22.73,33.71 22.91,33.89 22.91,35.46 23.09,35.64 39.62,35.64 39.8,35.46 39.8,32.08 43.56,28.32 43.56,20.83 43.05,20.32 41.02,20.32 v1(40.77,20.57)
CHASSIS_CANL: length 61
  Top Layer w0.254: P1.6 12.35,40.92 R11.1 ; v1(40.77,18.62) 40.69,18.54 D6.2 38.74,18.85 U5.6
  Bottom Layer w0.254: v1(40.77,18.62) 43.13,18.62 43.97,19.46 43.97,28.49 40.21,32.25 40.21,35.8 39.91,36.1 19.32,36.1 14.5,40.92 P1.6
CHASSIS_RX: length 6
  Top Layer w0.254: U5.4 30.44,16.64 28.68,16.64 28.61,16.56 28.12,16.56 28.05,16.64 26.14,16.64 U4.13
CHASSIS_TX: length 6.1
  Top Layer w0.254: U4.11 26.28,22.22 27.92,22.22 28.12,22.43 28.61,22.43 28.81,22.22 30.55,22.22 U5.1
CS: length 18
  Top Layer w0.254: 26.98,24.44 28.51,24.44 R14.2 ; 26.98,24.44 U4.10 ; 26.98,24.44 27.3,24.77 27.3,28.19 29.34,30.23 32.77,30.23 34.04,31.5 36.22,31.5 U3.7
ESP_ANALOG_LIGHT: length 2.3
  Top Layer w0.254: 28.26,42.28 26.01,42.28 U4.3
ESP_TRANS: length 47.8
  Top Layer w0.254: v1(22.73,23.62) R8.2 22.72,24.51 R7.1
  Bottom Layer w0.254: U4.20 44.32,30.11 44.32,19.31 43.05,18.03 40.52,18.03 34.94,23.62 34.16,23.62 34.15,23.63 26.61,23.63 26.38,23.4 25.52,23.4 25.3,23.62 v1(22.73,23.62)
INC: length 11.4
  Top Layer w0.254: U3.1 30.8,32.75 29.94,32.75 27.75,30.56 25.52,30.56 24.91,29.95 24.91,28.02 U4.9
LIN1: length 60.7
  Top Layer w0.254: 10.91,33.42 16.59,33.42 17.43,32.58 23.46,32.58 24.31,33.42 29.98,33.42 30.58,34.02 39.91,34.02 40.51,33.42 42.02,33.42 43.18,32.26 43.18,26.65 43,26.47 41.67,26.47 ; 10.91,33.42 12.18,34.69 12.44,34.69 12.47,34.66 14.7,34.66 14.87,34.83 14.87,37.64 17.65,40.43 v1(17.65,46.23) 17.72,46.23 D2.1 ; 10.91,33.42 P1.3
LIN1_RX: length 6.2
  Top Layer w0.254: U4.25 50.85,23.93 U1.1 46.78,23.9 R1.1
LIN1_TX: length 6.2
  Top Layer w0.254: U1.4 47.32,27.23 49.14,27.23 49.32,27.41 49.32,27.92 49.49,28.1 50.66,28.1 50.84,27.92 50.84,27.41 51.02,27.23 51.1,27.23 U4.24
LIN2: length 49.8
  Top Layer w0.254: D5.1 15.68,47.68 v1(14.22,46.23) ; 41.67,46.66 v1(39.62,46.66)
  Bottom Layer w0.254: P1.4 10.31,35.92 9.52,36.7 9.52,41.53 v1(14.22,46.23) 14.45,46.45 14.45,49.83 14.22,50.06 14.22,50.54 14.56,50.88 21.06,50.88 21.41,50.53 21.41,50.05 24.91,46.55 24.91,46.42 25.08,46.26 26.83,46.26 27.24,46.66 v1(39.62,46.66)
LIN2_RX: length 6.8
  Top Layer w0.254: 46.81,42.75 46.84,42.75 46.89,42.8 v1(47.88,42.8) ; 46.81,42.75 U2.1 ; 46.81,42.75 46.81,42.72 46.78,42.72
  Bottom Layer w0.254: v1(47.88,42.8) 47.91,42.8 49.87,44.76 U4.17
LIN2_TX: length 6.8
  Top Layer w0.254: U2.4 48.15,49.28 50.93,49.28 51.35,48.85 U4.16
LIN_CS: length 26.5
  Top Layer w0.254: U1.2 46.11,25.9 45.85,25.9 45.51,26.23 45.51,27 45.15,27.36 45.15,28.13 51.35,34.33 U4.21 49.28,36.68 49.28,44.7 48.58,45.39 U2.2
LIN_WAKE: length 30.3
  Top Layer w0.254: U1.3 46.11,27.17 45.85,27.17 45.51,27.5 45.51,27.98 45.85,28.31 48.65,28.31 51.35,31.01 U4.22 51.35,33.13 52.39,34.17 52.39,45.52 51.66,46.26 50.92,46.26 50.52,46.66 U2.3
OUTPUT1: length 36.4
  Top Layer w1.016: P1.10 9.18,37.46 9.18,43.6 14.93,49.34 20.38,49.34 21.72,48.01 21.72,37.23 Q1.2
PWR_IN: length 20.2
  Top Layer w1.016: D3.2 6.65,12.62 D1.1 6.62,12.68 R3.2 7.39,16.27 7.39,16.46 7.78,16.84 7.97,16.84 10.64,19.52 P1.1
RA: length 34.5
  Top Layer w0.254: v1(40.13,28.7) 40.13,29.62 R9.2
  Bottom Layer w0.254: P1.8 8.99,29.58 24.42,29.58 25.52,28.48 26.38,28.48 26.61,28.7 v1(40.13,28.7)
U/D: length 6.7
  Top Layer w0.254: U3.2 30.82,31.5 29.6,31.5 27.62,29.52 U4.8
$1N737: length 2.2
  Top Layer w0.254: R11.2 R_TERM1.2
$1N743: length 1.7
  Top Layer w0.254: U5.8 36.52,23 R10.2
$1N3329: length 7
  Top Layer w0.254: v1(20.83,50.29) 20.96,50.43 R2.2
  Bottom Layer w0.254: v1(20.83,50.29) 20.83,46.48 LIN1_MASTER.2
$1N3333: length 7.2
  Top Layer w0.254: R4.2 14.68,50.43 v1(14.81,50.3)
  Bottom Layer w0.254: v1(14.81,50.3) 14.81,46.47 14.81,46.47 14.81,46.02 LIN2_MASTER.2
$1N6845: length 2.3
  Top Layer w0.254: R9.1 U3.5
$1N12184: length 2
  Top Layer w0.254: R7.2 19.51,24.32 Q2.1
$1N12187: length 7.9
  Top Layer w0.254: Q2.3 18.8,25.27 R5.1 19.69,27.58 Q1.1
$1N12290: length 4
  Top Layer w0.254: U6.2 31.38,41.33 D7.1 34.04,40.29 R12.1
$1N14060: length 2.4
  Top Layer w0.254: D2.2 21.51,51.88 21.59,51.81
$1N14099: length 2.4
  Top Layer w0.254: 13.59,51.81 15.93,51.81 D5.2

## Copper pours and planes (outline as drawn; the poured copper is in the pictures)
GND on Top Layer: -0.89,56.77 56.01,56.77 56.01,-1.02 -0.89,-1.02
GND on Bottom Layer: -2.79,56.77 53.47,56.77 53.47,-0.89 -2.79,-0.89
GND on PWR: -2.41,56.39 56.01,56.39 56.01,-1.65 -2.41,-1.65
GND on GND: -2.92,57.02 56.01,57.02 56.01,-1.05 -2.92,-1.05

## Text on the board
Top Silkscreen Layer: MFSW Adapter | Forbes Automotive '26
